# EAGLE design H3BR7 (EAGLE 9.6.1)

## Sheet 1 of 2
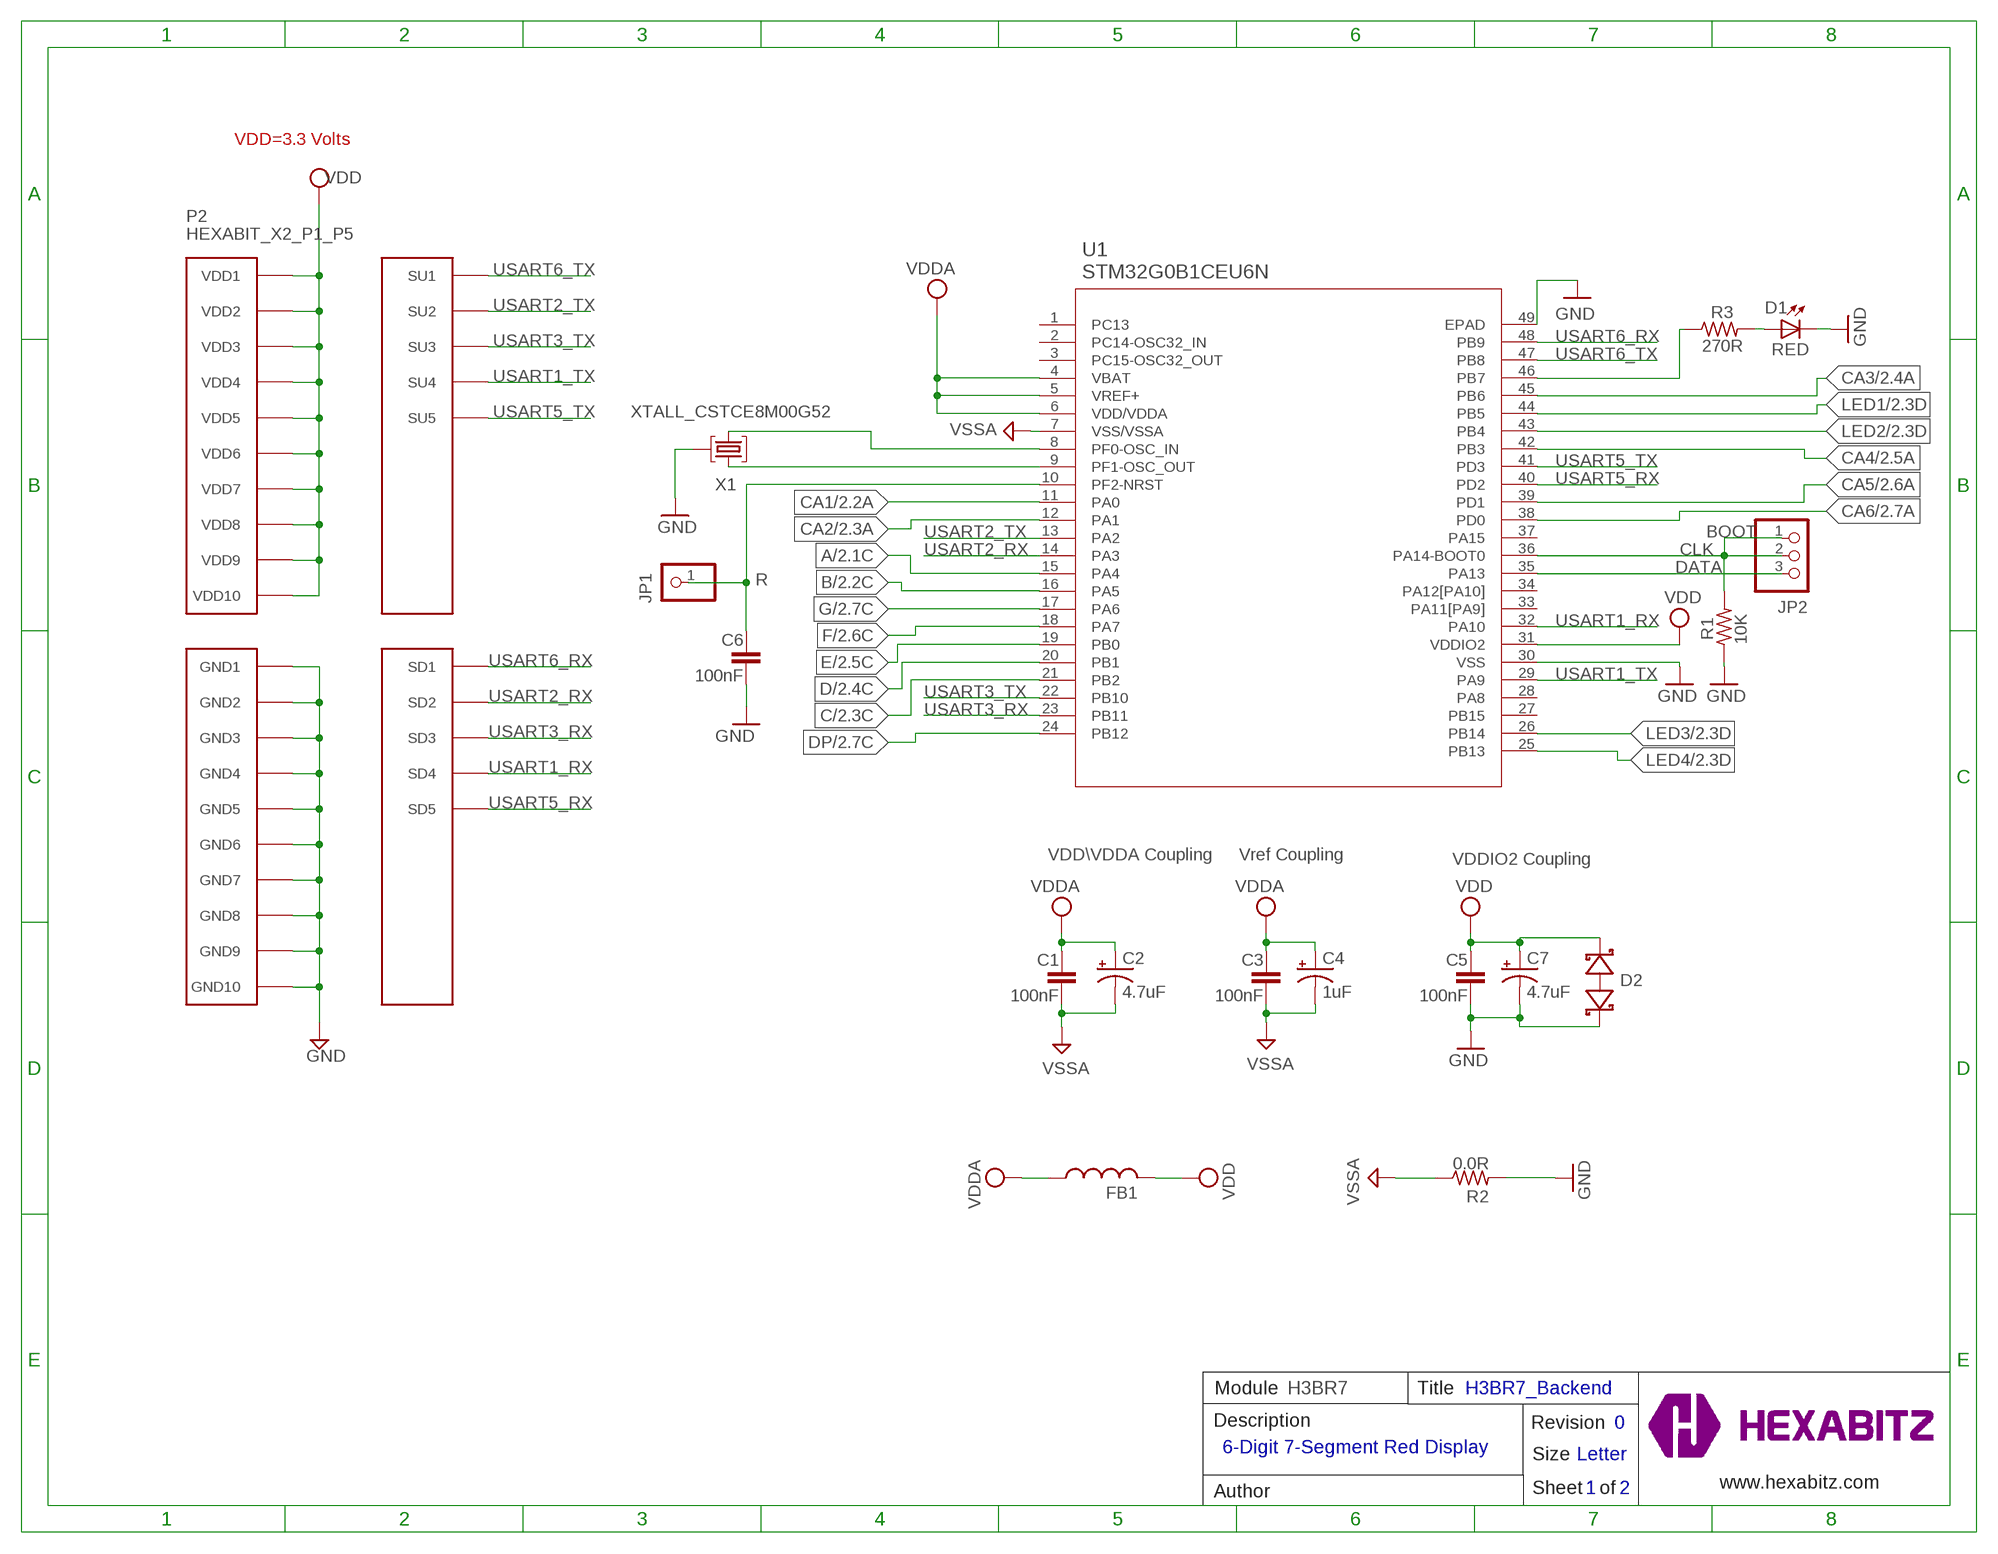
[diagram p0: schematic, sheet 1]

### Parts
C1  100nF  C-0603  [C-0603]
C2  4.7uF  C-0805-POL  [C-0805-POL]
C3  100nF  C-0603  [C-0603]
C4  1uF  C-0805-POL  [C-0805-POL]
C5  100nF  C-0603  [C-0603]
C6  100nF  C-0603  [C-0603]
C7  4.7uF  C-0805-POL  [C-0805-POL]
D1  RED  VLMS1300-GS08  [VLMS1300-GS08]
D2  BOURNS_CDSOD323-T03SCBOURNS_CDSOD323-T03SC_0_0  [BOURNS_CDSOD323-T03SC_0]
FB1  FB-0603  [FB-0603]
JP1  R  PINHD-1X1  [1X01]
JP2  PINHD-1X3  [1X03]
P2  HEXABIT_X2_P1_P5  [HEXABIT_17.32_X2_P1_P5]
R1  10K  R-0603  [R-0603]
R2  0.0R  R-0603  [R-0603]
R3  270R  R-0603  [R-0603]
U1  STM32G0B1CEU6N  [HEXABITZ_ICS_QFN_B1CEU6_STM-L]
X1  XTALL_CSTCE8M00G52  [XTALL_CSTCE8M00G52]

### Nets
A: U1.15(PA4) ; also sheet 2
B: U1.16(PA5) ; also sheet 2
C: U1.21(PB2) ; also sheet 2
CA1: U1.11(PA0) ; also sheet 2
CA2: U1.12(PA1) ; also sheet 2
CA3: U1.45(PB6) ; also sheet 2
CA4: U1.42(PB3) ; also sheet 2
CA5: U1.39(PD1) ; also sheet 2
CA6: U1.38(PD0) ; also sheet 2
CLK: JP2.1 JP2.2 R1.2 U1.36(PA14-BOOT0)
D: U1.20(PB1) ; also sheet 2
DATA: JP2.3 U1.35(PA13)
DP: U1.24(PB12) ; also sheet 2
E: U1.19(PB0) ; also sheet 2
F: U1.18(PA7) ; also sheet 2
G: U1.17(PA6) ; also sheet 2
GND: C5.2 C6.2 C7.2(-) D1.C D2.1(A) P2.PAD_PD11(GND1) P2.PAD_PD12(GND2) P2.PAD_PD13(GND3) P2.PAD_PD14(GND4) P2.PAD_PD15(GND5) P2.PAD_PD16(GND6) P2.PAD_PD17(GND7) P2.PAD_PD18(GND8) P2.PAD_PD19(GND9) P2.PAD_PD20(GND10) R1.1 R2.2 U1.30(VSS) U1.49(EPAD) X1.P$2 ; also sheet 2
LED1: U1.44(PB5) ; also sheet 2
LED2: U1.43(PB4) ; also sheet 2
LED3: U1.26(PB14) ; also sheet 2
LED4: U1.25(PB13) ; also sheet 2
N$1: D1.A R3.2
N$2: R3.1 U1.46(PB7)
N$5: U1.9(PF1-OSC_OUT) X1.P$1
N$6: U1.8(PF0-OSC_IN) X1.P$3
N$8: C6.1 JP1.1 U1.10(PF2-NRST)
USART1_RX: P2.PAD_PD4(SD4) U1.32(PA10)
USART1_TX: P2.PAD_PU4(SU4) U1.29(PA9)
USART2_RX: P2.PAD_PD2(SD2) U1.14(PA3)
USART2_TX: P2.PAD_PU2(SU2) U1.13(PA2)
USART3_RX: P2.PAD_PD3(SD3) U1.23(PB11)
USART3_TX: P2.PAD_PU3(SU3) U1.22(PB10)
USART5_RX: P2.PAD_PD5(SD5) U1.40(PD2)
USART5_TX: P2.PAD_PU5(SU5) U1.41(PD3)
USART6_RX: P2.PAD_PD1(SD1) U1.48(PB9)
USART6_TX: P2.PAD_PU1(SU1) U1.47(PB8)
VDD: C5.1 C7.1(+) D2.2(C) FB1.2 P2.PAD_PU11(VDD1) P2.PAD_PU12(VDD2) P2.PAD_PU13(VDD3) P2.PAD_PU14(VDD4) P2.PAD_PU15(VDD5) P2.PAD_PU16(VDD6) P2.PAD_PU17(VDD7) P2.PAD_PU18(VDD8) P2.PAD_PU19(VDD9) P2.PAD_PU20(VDD10) U1.31(VDDIO2) ; also sheet 2
VDDA: C1.1 C2.1(+) C3.1 C4.1(+) FB1.1 U1.4(VBAT) U1.5(VREF+) U1.6(VDD/VDDA)
VSSA: C1.2 C2.2(-) C3.2 C4.2(-) R2.1 U1.7(VSS/VSSA)
Unconnected: U1.1(PC13) U1.2(PC14-OSC32_IN) U1.3(PC15-OSC32_OUT) U1.27(PB15) U1.28(PA8) U1.33(PA11[PA9]) U1.34(PA12[PA10]) U1.37(PA15)

### Notes on the sheet
- VDD=3.3 Volts
- BOOT
- VDD\VDDA Coupling | Vref Coupling | VDDIO2 Coupling
- Module | H3BR7 | Title | H3BR7_Backend
- Description | Revision | 0
- 6-Digit 7-Segment Red Display
- Size | Letter
- www.hexabitz.com
- Author | Sheet   of | 1 | 2
- C:/Users/Admin/Desktop/logodraft.bmp

## Sheet 2 of 2
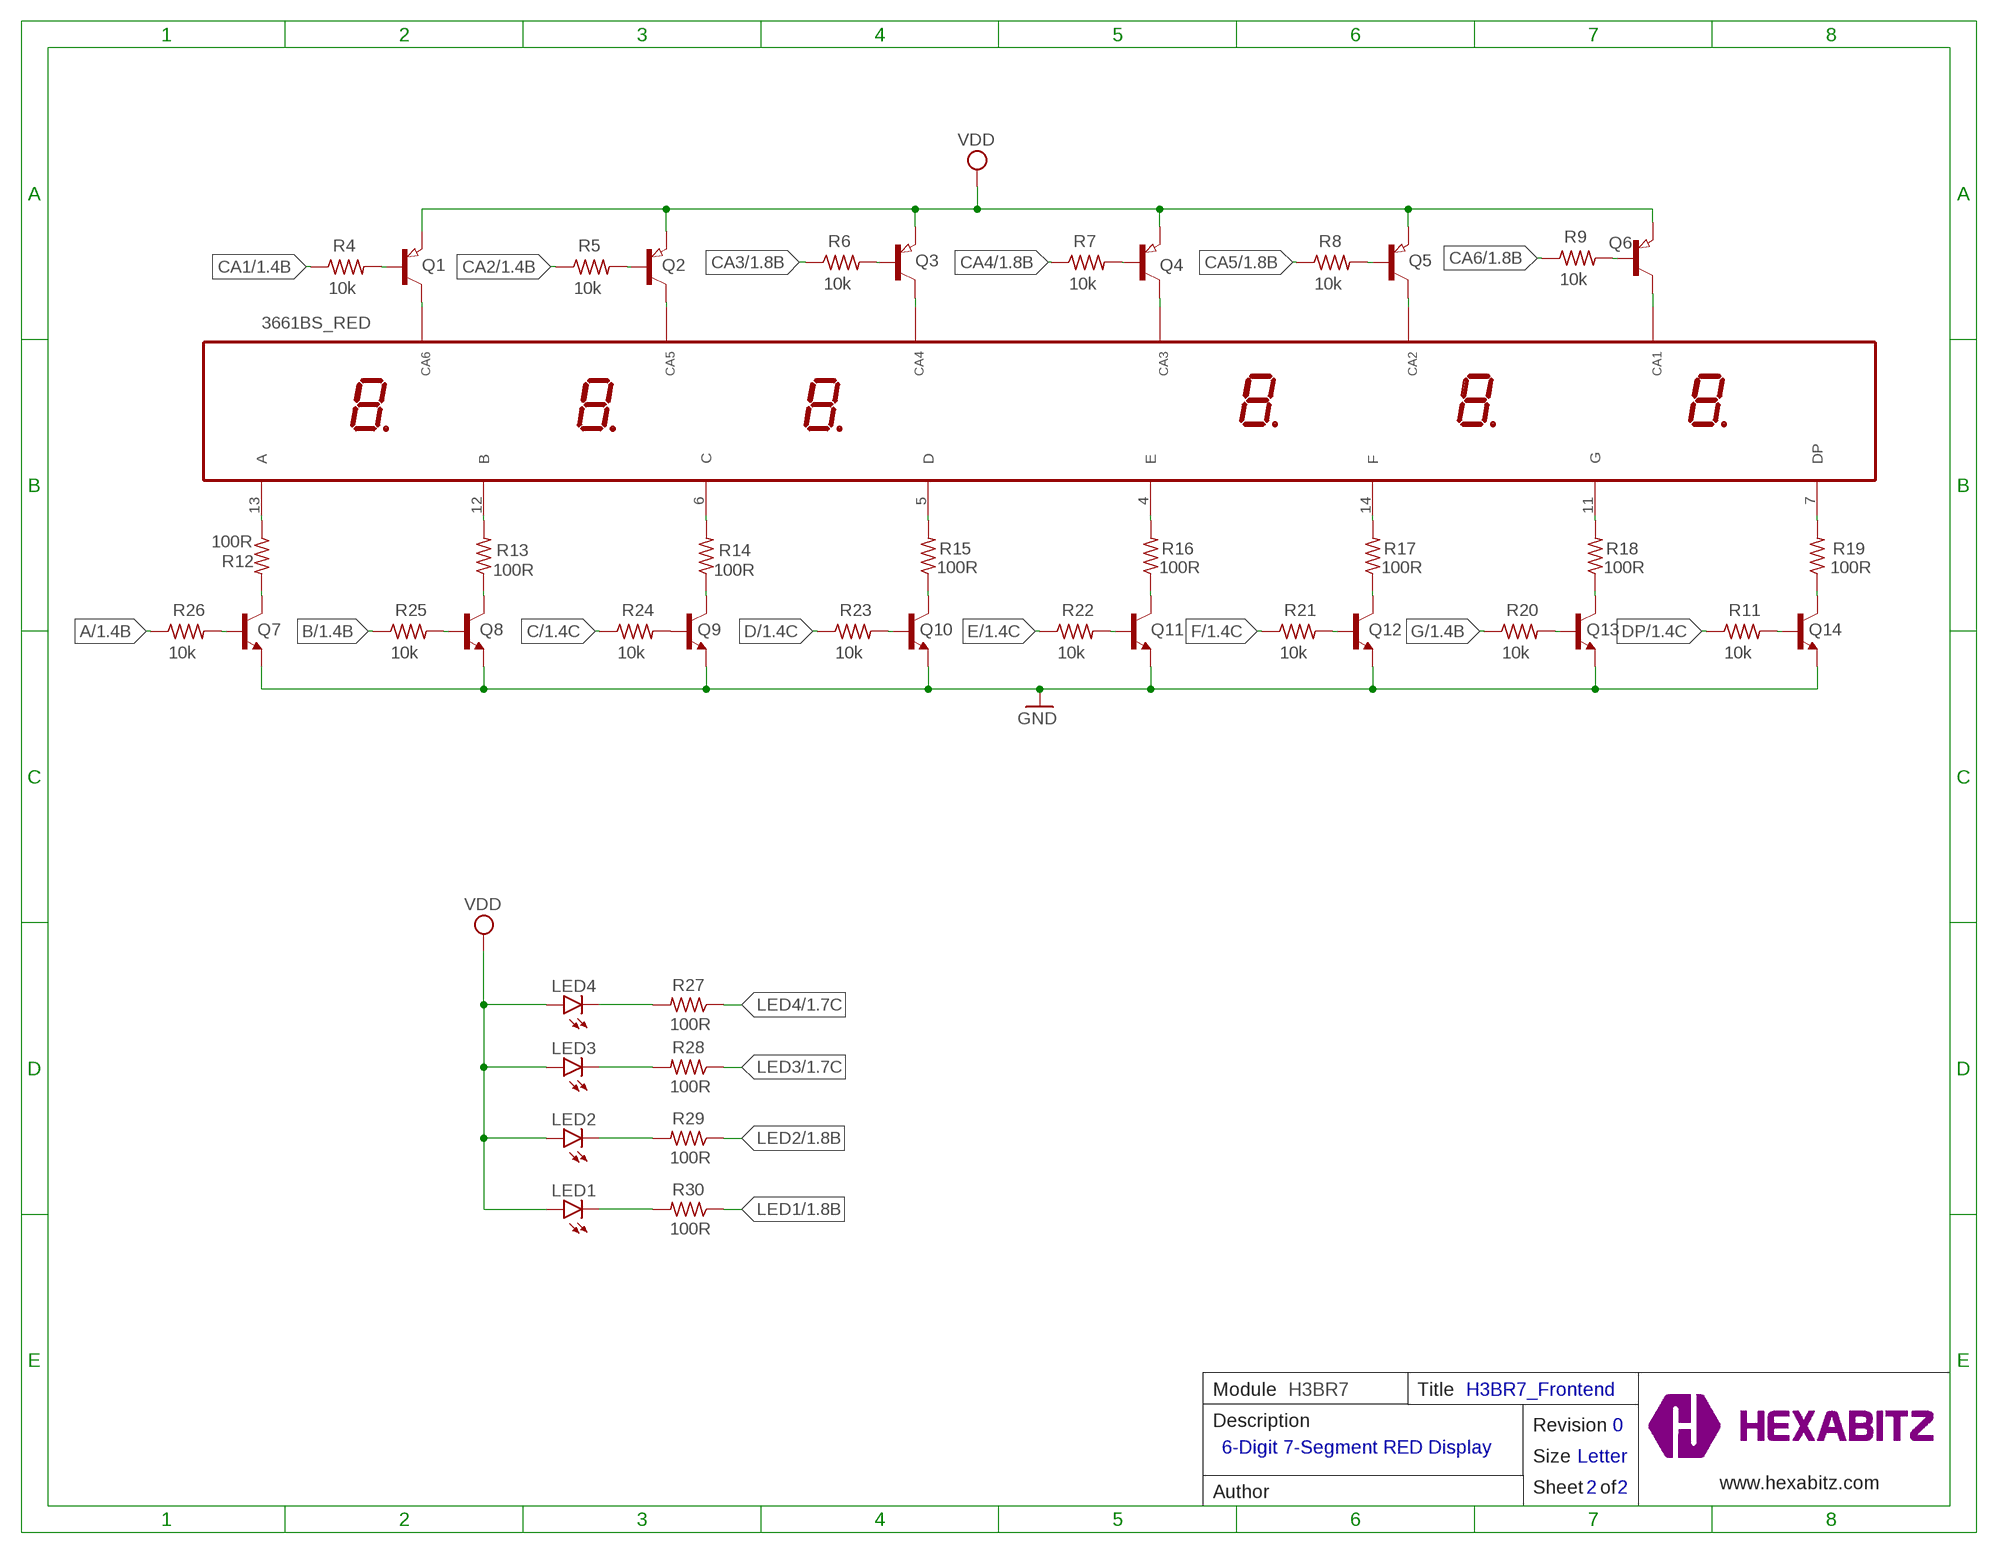
[diagram p1: schematic, sheet 2]

### Parts
3661BS  3661BS_RED  [3661BS]
LED1  LED-3MM3MM  [LED3MM]
LED2  LED-3MM3MM  [LED3MM]
LED3  LED-3MM3MM  [LED3MM]
LED4  LED-3MM3MM  [LED3MM]
Q1  SEMICON-SMD-IPC_PNP-TRANSISTOR_SOT23  [SEMICON-SMD-IPC_SOT23]
Q2  SEMICON-SMD-IPC_PNP-TRANSISTOR_SOT23  [SEMICON-SMD-IPC_SOT23]
Q3  SEMICON-SMD-IPC_PNP-TRANSISTOR_SOT23  [SEMICON-SMD-IPC_SOT23]
Q4  SEMICON-SMD-IPC_PNP-TRANSISTOR_SOT23  [SEMICON-SMD-IPC_SOT23]
Q5  SEMICON-SMD-IPC_PNP-TRANSISTOR_SOT23  [SEMICON-SMD-IPC_SOT23]
Q6  SEMICON-SMD-IPC_PNP-TRANSISTOR_SOT23  [SEMICON-SMD-IPC_SOT23]
Q7  MMBT3904LT1  [MMBT3904LT1]
Q8  MMBT3904LT1  [MMBT3904LT1]
Q9  MMBT3904LT1  [MMBT3904LT1]
Q10  MMBT3904LT1  [MMBT3904LT1]
Q11  MMBT3904LT1  [MMBT3904LT1]
Q12  MMBT3904LT1  [MMBT3904LT1]
Q13  MMBT3904LT1  [MMBT3904LT1]
Q14  MMBT3904LT1  [MMBT3904LT1]
R4  10k  R-0603  [R-0603]
R5  10k  R-0603  [R-0603]
R6  10k  R-0603  [R-0603]
R7  10k  R-0603  [R-0603]
R8  10k  R-0603  [R-0603]
R9  10k  R-0603  [R-0603]
R11  10k  R-0603  [R-0603]
R12  100R  R-0603  [R-0603]
R13  100R  R-0603  [R-0603]
R14  100R  R-0603  [R-0603]
R15  100R  R-0603  [R-0603]
R16  100R  R-0603  [R-0603]
R17  100R  R-0603  [R-0603]
R18  100R  R-0603  [R-0603]
R19  100R  R-0603  [R-0603]
R20  10k  R-0603  [R-0603]
R21  10k  R-0603  [R-0603]
R22  10k  R-0603  [R-0603]
R23  10k  R-0603  [R-0603]
R24  10k  R-0603  [R-0603]
R25  10k  R-0603  [R-0603]
R26  10k  R-0603  [R-0603]
R27  100R  R-0603  [R-0603]
R28  100R  R-0603  [R-0603]
R29  100R  R-0603  [R-0603]
R30  100R  R-0603  [R-0603]
TRIMBLE-LOGO1  HEXA-LOGO  [HEXA-LOGO]

### Nets
A: R26.1 ; also sheet 1
B: R25.1 ; also sheet 1
C: R24.1 ; also sheet 1
CA1: R4.1 ; also sheet 1
CA2: R5.1 ; also sheet 1
CA3: R6.1 ; also sheet 1
CA4: R7.1 ; also sheet 1
CA5: R8.1 ; also sheet 1
CA6: R9.1 ; also sheet 1
D: R23.1 ; also sheet 1
DP: R11.1 ; also sheet 1
E: R22.1 ; also sheet 1
F: R21.1 ; also sheet 1
G: R20.1 ; also sheet 1
GND: Q7.2(E) Q8.2(E) Q9.2(E) Q10.2(E) Q11.2(E) Q12.2(E) Q13.2(E) Q14.2(E) ; also sheet 1
LED1: R30.1 ; also sheet 1
LED2: R29.1 ; also sheet 1
LED3: R28.1 ; also sheet 1
LED4: R27.1 ; also sheet 1
N$3: 3661BS.13(A) R12.1
N$4: Q7.1(B) R26.2
N$7: Q8.3(C) R13.1
N$9: 3661BS.6(C) R14.2
N$10: Q8.1(B) R25.2
N$11: Q9.1(B) R24.2
N$12: Q10.1(B) R23.2
N$13: Q11.1(B) R22.2
N$14: Q12.1(B) R21.2
N$15: Q13.1(B) R20.2
N$16: Q14.1(B) R11.2
N$17: Q10.3(C) R15.1
N$18: 3661BS.5(D) R15.2
N$19: Q11.3(C) R16.1
N$20: Q13.3(C) R18.1
N$21: 3661BS.11(G) R18.2
N$22: Q7.3(C) R12.2
N$23: LED4.K(C) R27.2
N$24: LED3.K(C) R28.2
N$25: Q1.1(B) R4.2
N$26: Q2.1(B) R5.2
N$27: Q3.1(B) R6.2
N$28: Q4.1(B) R7.2
N$29: Q5.1(B) R8.2
N$30: Q6.1(B) R9.2
N$31: 3661BS.1(CA) Q6.3(C)
N$32: LED2.K(C) R29.2
N$33: LED1.K(C) R30.2
N$34: 3661BS.8(CA) Q1.3(C)
N$35: 3661BS.9(CA) Q2.3(C)
N$36: 3661BS.10(CA) Q3.3(C)
N$37: 3661BS.3(CA) Q4.3(C)
N$38: 3661BS.2(CA) Q5.3(C)
N$39: 3661BS.7(DP) R19.2
N$40: Q14.3(C) R19.1
N$41: 3661BS.4(E) R16.2
N$42: 3661BS.14(F) R17.2
N$43: 3661BS.12(B) R13.2
N$44: Q12.3(C) R17.1
N$45: Q9.3(C) R14.1
VDD: LED1.A LED2.A LED3.A LED4.A Q1.2(E) Q2.2(E) Q3.2(E) Q4.2(E) Q5.2(E) Q6.2(E) ; also sheet 1

### Notes on the sheet
- Module | H3BR7 | Title | H3BR7_Frontend
- Description | Revision | 0
- 6-Digit 7-Segment RED Display
- Size | Letter
- Sheet   of | 2 | 2 | www.hexabitz.com
- Author
- C:/Users/Admin/Desktop/logodraft.bmp

## Library data of the parts
3661BS = HEXABITZ_ICs:3661BS_RED: 0.36inch 6digits RED 8 segment led display 3661BS
C1 C3 C5 C6 = HEXABITZ_RCLS:C-0603: CAP CER 10% X7R 0603
C2 C4 C7 = HEXABITZ_RCLS:C-0805-POL: Cap Tant Solid SMD 2012
D1 = Hexabitz:VLMS1300-GS08: Red 0603 130° Clear 54 mcd 2 V Surface Mount ChipLED ; Octopart Url : http://octopart.com/vlms1300-gs08-vishay-21709201; MFN: Vishay; MPN: VLMS1300-GS08; OCTOPART_URL: https://octopart.com/vlms1300-gs08-vishay-21709201?r=sp&s=_gcP4_q8T1SC6PJQPTQ9yA
D2 = HEXABITZ_RCLS:BOURNS_CDSOD323-T03SC: CDSOD323-TxxSC - TVS Diode Series; DESCRIPTION: Dio Tvs Vwm 03V 500W Bidir Sod323 / Tape & Reel - 7" Reel; MFN: Bourns; MPN: CDSOD323-T03SC; OCTOPART_URL: https://octopart.com/cdsod323-t03sc-bourns-10487153?r=sp
FB1 = HEXABITZ_RCLS:FB-0603: Ferrite Beads Multi-Layer 0603
JP1 = HEXABITZ_USER_INTERFACE_PARTS:PINHD-1X1: PIN HEADER; MFN: TE Connectivity; MPN: 87227-1; OCTOPART_URL: https://octopart.com/87227-1-te+connectivity-39512052?r=sp
JP2 = pinhead:PINHD-1X3: PIN HEADER
LED1-LED4 = HEXABITZ_USER_INTERFACE_PARTS:LED-3MM: LED OSRAM: - CHIPLED LG R971, LG N971, LY N971, LG Q971, LY Q971, LO R971, LY R971 LH N974, LH R974 LS Q976, LO Q976, LY Q976 LO Q996 - Hyper CHIPLED LW Q18S LB Q993, LB Q99A, LB R99A - SideLED LS A670, LO A670, LY A670, LG A670, LP A670 LB A673, LV A673, LT A673, LW A673 LH A674 LY A675 LS A676, LA A676, LO A676, LY A676, LW A676 LS A679, LY A679, LG A679 - Hyper Micro SIDELED® LS Y876, LA Y876, LO Y876, LY Y876 LT Y87S - SmartLED LW L88C, LW L88S LB L89C, LB L89S, LG L890 LS L89K, LO L89K, LY L89K LS L896, LA L896, LO L896, LY L896 - TOPLED LS T670, LO T670, LY T670, LG T670, LP T670 LSG T670, LSP T670, LSY T670, LOP T670, LYG T670 LG T671, LOG T671, LSG T671 LB T673, LV T673, LT T673, LW T673 LH T674 LS T676, LA T676, LO T676, LY T676, LB T676, LH T676, LSB T676, LW T676 LB T67C, LV T67C, LT T67C, LS T67K, LO T67K, LY T67K, LW E67C LS E67B, LA E67B, LO E67B, LY E67B, LB E67C, LV E67C, LT E67C LW T67C LS T679, LY T679, LG T679 LS T770, LO T770, LY T770, LG T770, LP T770 LB T773, LV T773, LT T773, LW T773 LH T774 LS E675, LA E675, LY E675, LS T675 LS T776, LA T776, LO T776, LY T776, LB T776 LHGB T686 LT T68C, LB T68C - Hyper Mini TOPLED® LB M676 - Mini TOPLED Santana® LG M470 LS M47K, LO M47K, LY M47K Source: http://www.osram.convergy.de LUXEON: - LUMILED® LXK2-PW12-R00, LXK2-PW12-S00, LXK2-PW14-U00, LXK2-PW14-V00 LXK2-PM12-R00, LXK2-PM12-S00, LXK2-PM14-U00 LXK2-PE12-Q00, LXK2-PE12-R00, LXK2-PE12-S00, LXK2-PE14-T00, LXK2-PE14-U00 LXK2-PB12-K00, LXK2-PB12-L00, LXK2-PB12-M00, LXK2-PB14-N00, LXK2-PB14-P00, LXK2-PB14-Q00 LXK2-PR12-L00, LXK2-PR12-M00, LXK2-PR14-Q00, LXK2-PR14-R00 LXK2-PD12-Q00, LXK2-PD12-R00, LXK2-PD12-S00 LXK2-PH12-R00, LXK2-PH12-S00 LXK2-PL12-P00, LXK2-PL12-Q00, LXK2-PL12-R00 Source: www.luxeon.com KINGBRIGHT: KA-3528ASYC Source: www.kingbright.com
P2 = hexabitz_connectors:HEXABIT_X2_P1_P5
Q1-Q6 = HEXABITZ_RCLS:SEMICON-SMD-IPC_PNP-TRANSISTOR_: PNP TRANSISTOR
Q7-Q14 = HEXABITZ_RCLS:MMBT3904LT1: TRANS NPN 40V 0.2A SOT23; MOUNTING_STYLE: Surface Mount; NUM_OF_PINS: 3; PACKAGE: SOT-23-3; PACKAGING: Reel; PRODUCT_CATEGORY: Transistors Bipolar-BJT; SERIES: MMBT3904L
R1-R9 R11-R30 = HEXABITZ_RCLS:R-0603: Thick Film Resistors - SMD 0603
TRIMBLE-LOGO1 = HEXABITZ_USER_INTERFACE_PARTS:HEXA-LOGO: Trimble-Logo
U1 = HEXABITZ_ICs:STM32G0B1CEU6N
X1 = Hexabitz:XTALL_CSTCE8M00G52: MURATA CSTCE8M00G52-R0 RESONATOR, SMD, 8MHZ ; Octopart Url : https://octopart.com/cstce8m00g52-r0-murata-7145559; MFN: Murata; MPN: CSTCE8M00G52Z-R0; OCTOPART_URL: https://octopart.com/cstce8m00g52z-r0-murata-17755941?r=sp&s=JDnNJnrHQhyS8Zk4ofFWXw

## Board
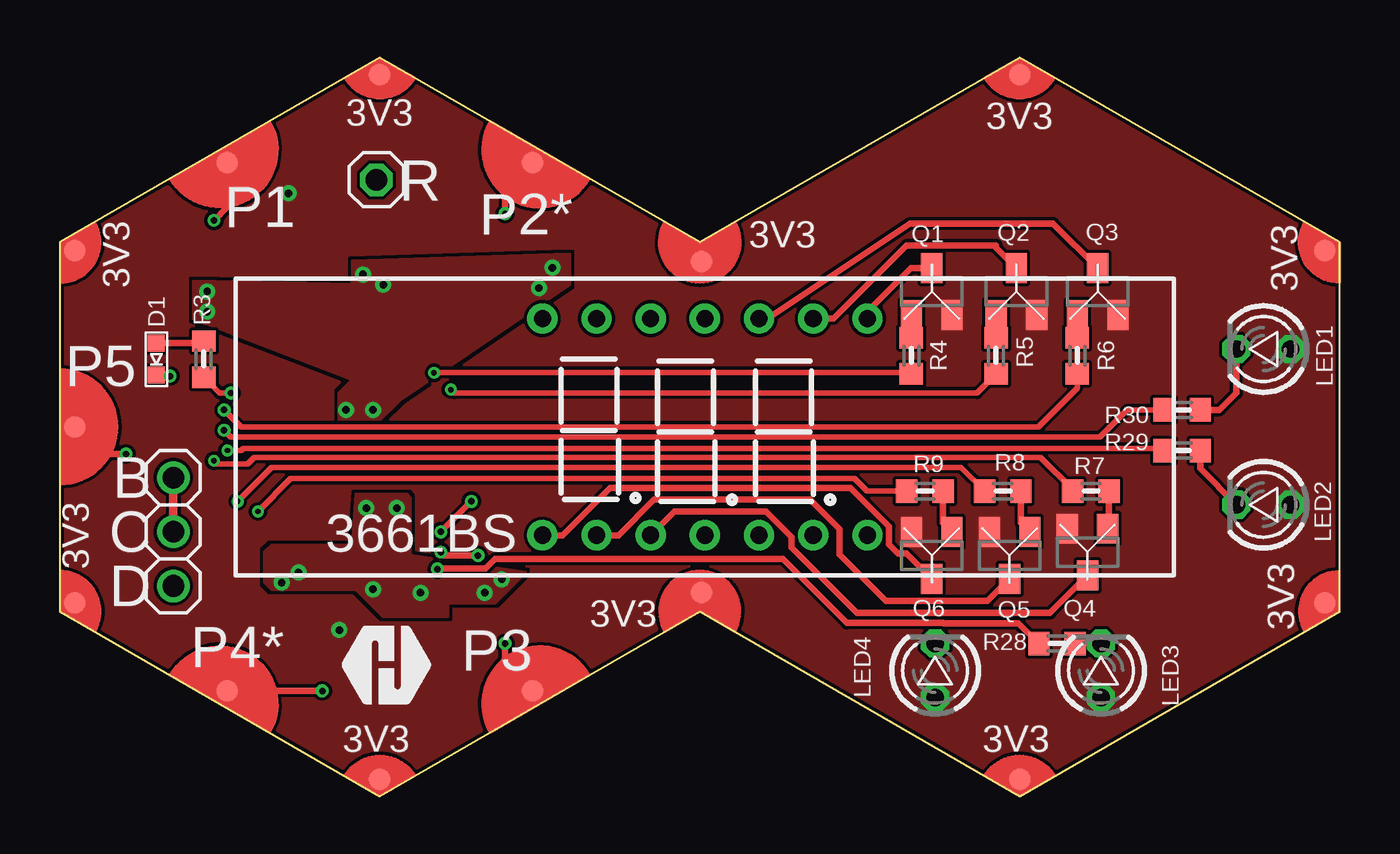
[diagram p2: board, top side]
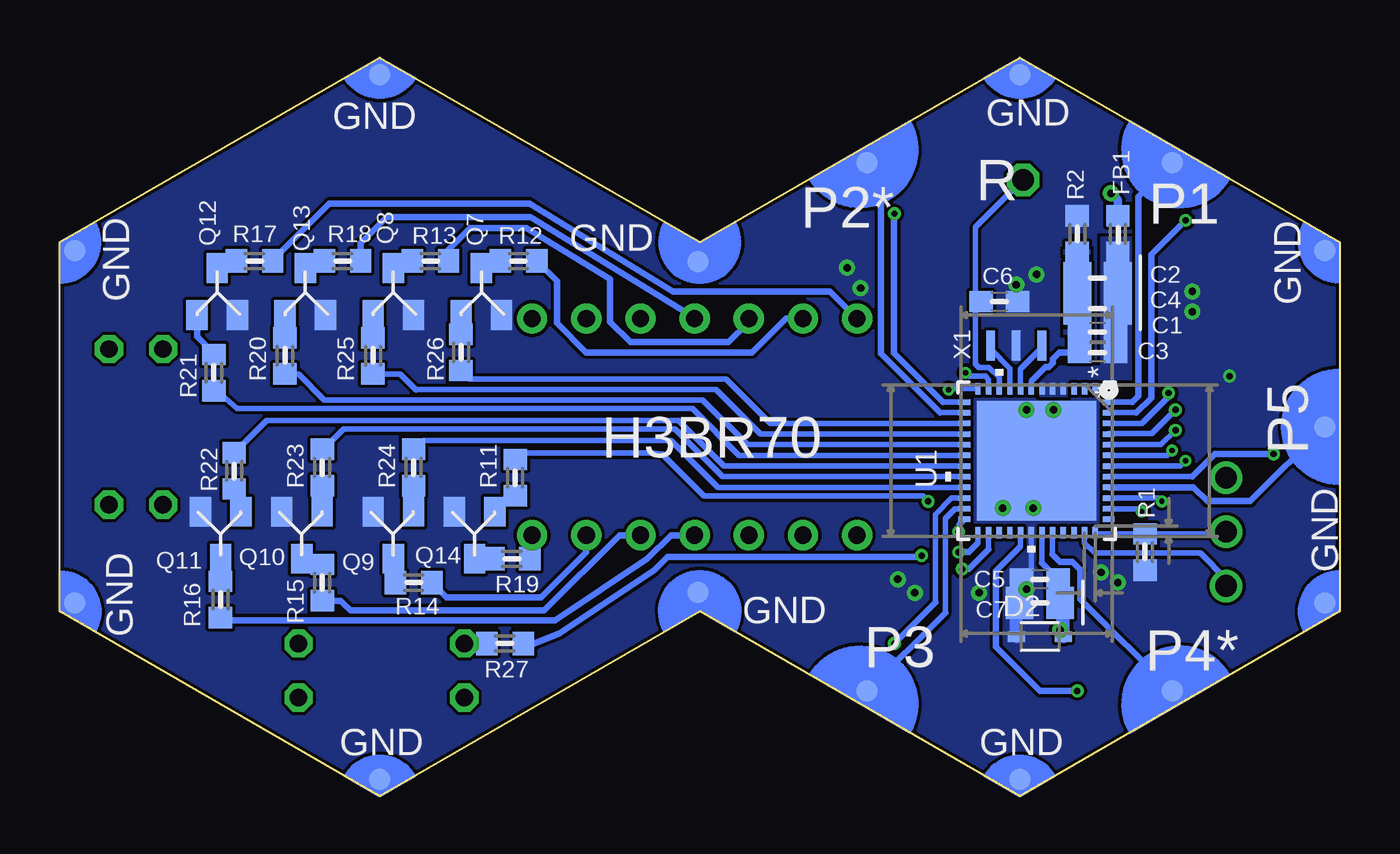
[diagram p3: board, bottom side, seen from below]

Size 60 x 34.64 mm. Coordinates in mm from the lower left corner, seen from the top.
Copper layers (1*16): Top 0.035mm / dielectric 1.5mm / Bottom 0.035mm
Design rules "default *": minimum track width 6mil, minimum drill 0.2mm, track to track 6mil, track to pad 6mil, pad to pad 6mil, via to via 6mil, smd to smd 0mil, copper to edge 0.15mm, drill to drill 6mil, minimum pad ring 10mil, minimum via ring 4mil, stop-mask expansion 4mil, vias tented up to drill 24mil, thermal gap 10mil

### Footprints (pad centres in the part's own frame; a part is rotated, then mirrored left to right if it is on the bottom)
3661BS = drill 0.8 pad 1.422: 1 -7.62,-5.08; 2 -5.08,-5.08; 3 -2.54,-5.08; 4 0,-5.08; 5 2.54,-5.08; 6 5.08,-5.08; 7 7.62,-5.08; 8 7.62,5.08; 9 5.08,5.08; 10 2.54,5.08; 11 0,5.08; 12 -2.54,5.08; 13 -5.08,5.08; 14 -7.62,5.08
C-0603 = smd 1.1 x 1: 1 -0.85,0; 2 0.85,0
C-0805-POL = smd 1.3 x 1.5: 1 -0.95,0; 2 0.95,0
VLMS1300-GS08 = smd 0.8 x 0.8: A 0,0.75; C 0,-0.75
BOURNS_CDSOD323-T03SC_0 = smd 0.8 x 0.5: 1 -1.1,0; 2 1.1,0
FB-0603 = smd 1 x 1.1: 1 -0.85,0; 2 0.85,0
1X01 = drill 1.016 octagon: 1 0,0
1X03 = drill 1.016: 1 -2.54,0; 2 0,0; 3 2.54,0
LED3MM = drill 0.813 octagon: A -1.27,0; K 1.27,0
HEXABIT_17.32_X2_P1_P5 = smd 1 x 1 bottom: PAD_PD1 12.39,22.39; PAD_PD2 12.39,8.09; PAD_PD3 -12.39,8.09; PAD_PD4 -12.39,22.39; PAD_PD5 0,29.55; PAD_PD12 16.52,15.24; PAD_PD13 7.752,0.168; PAD_PD14 16.52,-14.76; PAD_PD15 8.26,-29.07; PAD_PD16 -8.26,-29.07; PAD_PD17 -16.52,-14.76; PAD_PD18 -7.752,0.168; PAD_PD19 -16.52,15.24 | smd 1 x 1 rotated 60 bottom: PAD_PD11 8.26,29.547 | smd 1 x 1 rotated 120 bottom: PAD_PD20 -8.26,29.547 | smd 1 x 1: PAD_PU1 12.39,22.39; PAD_PU2 12.39,8.09; PAD_PU3 -12.39,8.09; PAD_PU4 -12.39,22.39; PAD_PU5 0,29.55; PAD_PU12 16.52,15.24; PAD_PU13 7.752,0.168; PAD_PU14 16.52,-14.76; PAD_PU15 8.26,-29.07; PAD_PU16 -8.26,-29.07; PAD_PU17 -16.52,-14.76; PAD_PU18 -7.752,0.168; PAD_PU19 -16.52,15.24 | smd 1 x 1 rotated 60: PAD_PU11 8.26,29.547 | smd 1 x 1 rotated 120: PAD_PU20 -8.26,29.547
SEMICON-SMD-IPC_SOT23 = smd 1 x 1.4: 1 -0.95,-1.1; 2 0.95,-1.1; 3 0,1.1
MMBT3904LT1 = smd 1 x 1.4: 1 -0.95,-1.1; 2 0.95,-1.1; 3 0,1.1
R-0603 = smd 1 x 1.1: 1 -0.85,0; 2 0.85,0
HEXABITZ_ICS_QFN_B1CEU6_STM-L = smd 0.55 x 0.254: 1 -3.38,2.751; 2 -3.38,2.251; 3 -3.38,1.75; 4 -3.38,1.25; 5 -3.38,0.75; 6 -3.38,0.25; 7 -3.38,-0.25; 8 -3.38,-0.75; 9 -3.38,-1.25; 10 -3.38,-1.75; 11 -3.38,-2.251; 12 -3.38,-2.751; 25 3.38,-2.751; 26 3.38,-2.251; 27 3.38,-1.75; 28 3.38,-1.25; 29 3.38,-0.75; 30 3.38,-0.25; 31 3.38,0.25; 32 3.38,0.75; 33 3.38,1.25; 34 3.38,1.75; 35 3.38,2.251; 36 3.38,2.751 | smd 0.254 x 0.55: 13 -2.751,-3.38; 14 -2.251,-3.38; 15 -1.75,-3.38; 16 -1.25,-3.38; 17 -0.75,-3.38; 18 -0.25,-3.38; 19 0.25,-3.38; 20 0.75,-3.38; 21 1.25,-3.38; 22 1.75,-3.38; 23 2.251,-3.38; 24 2.751,-3.38; 37 2.751,3.38; 38 2.251,3.38; 39 1.75,3.38; 40 1.25,3.38; 41 0.75,3.38; 42 0.25,3.38; 43 -0.25,3.38; 44 -0.75,3.38; 45 -1.25,3.38; 46 -1.75,3.38; 47 -2.251,3.38; 48 -2.751,3.38 | smd 5.6 x 5.6: 49 0,0
XTALL_CSTCE8M00G52 = smd 1.4 x 0.4: P$1 0,1.2; P$2 0,0; P$3 0,-1.2

### Placement (x,y rotation side)
3661BS  30.24,17.32 0 top
C1  11.35,21.77 180 bottom
C2  11.35,24.3 180 bottom
C3  11.35,20.81 180 bottom
C4  11.35,22.88 180 bottom
C5  14.05,10.18 180 bottom
C6  15.95,23.19 0 bottom
C7  14.05,9.07 180 bottom
D1  4.52,20.5 0 top
D2  14.05,7.48 0 bottom
FB1  10.4,26.37 90 bottom
JP1  14.84,28.91 0 top
JP2  5.32,12.4 270 top
LED1  56.43,20.97 180 top
LED2  56.43,13.67 180 top
LED3  48.81,5.89 90 top
LED4  41.03,5.89 90 top
P2  30.24,17.32 90 top
Q1  40.88,23.67 0 top
Q2  44.84,23.67 0 top
Q3  48.66,23.67 0 top
Q4  48.18,11.45 180 top
Q5  44.53,11.29 180 top
Q6  40.88,11.29 180 top
Q7  40.24,23.67 0 bottom
Q8  44.37,23.67 0 bottom
Q9  44.37,12.24 180 bottom
Q10  48.66,12.24 180 bottom
Q11  52.47,12.24 180 bottom
Q12  52.62,23.67 0 bottom
Q13  48.5,23.67 0 bottom
Q14  40.56,12.24 180 bottom
R1  9.13,11.45 90 bottom
R2  12.3,26.37 90 bottom
R3  6.75,20.5 90 top
R4  39.92,20.65 90 top
R5  43.89,20.65 90 top
R6  47.7,20.65 90 top
R7  48.34,14.3 0 top
R8  44.21,14.3 0 top
R9  40.56,14.3 0 top
R11  38.65,14.94 270 bottom
R12  38.49,25.1 180 bottom
R13  42.62,25.1 0 bottom
R14  43.42,10.02 0 bottom
R15  47.7,10.02 270 bottom
R16  52.47,9.22 270 bottom
R17  50.88,25.1 0 bottom
R18  46.75,25.1 0 bottom
R19  38.81,11.13 0 bottom
R20  49.45,20.65 90 bottom
R21  52.78,19.86 90 bottom
R22  51.83,15.26 270 bottom
R23  47.7,15.42 270 bottom
R24  43.42,15.42 270 bottom
R25  45.32,20.65 90 bottom
R26  41.19,20.81 90 bottom
R27  39.13,7.16 180 bottom
R28  46.75,7.16 0 top
R29  52.62,16.21 0 top
R30  52.62,18.11 0 top
TRIMBLE-LOGO1  15.32,4.3 0 top
U1  14.21,15.73 270 bottom
X1  15.16,21.13 90 bottom

### Tracks (layer width: path | path; a pad name or v marks a point on that pad's centre or on a via)
A
  Bottom 0.254: R26.1 40.79,19.56 28.78,19.56 26.69,17.48 U1.15
B
  Bottom 0.254: R25.1 44.05,19.8 43.31,19.06 43.29,19.07 29.23,19.07 27.15,16.98 U1.16
C
  Bottom 0.254: R24.1 43.36,16.26 42.94,16.68 31.35,16.68 29.15,14.48 U1.21
CA1  (via drill 0.25 pad 0.55)
  Top 0.254: R4.1 39.87,19.86 v17.54,19.86
  Bottom 0.254: U1.11 16.46,19.55 16.61,19.7 17.38,19.7 v17.54,19.86
CA2  (via drill 0.25 pad 0.55)
  Top 0.254: R5.1 43,18.91 18.49,18.91 v18.33,19.07
  Bottom 0.254: U1.12 18.29,19.11 v18.33,19.07
CA3  (via drill 0.3 pad 0.6)
  Top 0.254: R6.1 47.7,19.15 45.87,17.32 8.49,17.32 v7.7,18.11
  Bottom 0.254: v7.7,18.11 8.81,17 10.81,17 U1.45
CA4  (via drill 0.25 pad 0.55)
  Top 0.254: R7.1 47.49,14.38 45.98,15.89 9.12,15.89 8.81,15.58 7.37,15.58 v7.22,15.73
  Bottom 0.254: U1.42 7.47,15.48 v7.22,15.73
CA5  (via drill 0.25 pad 0.55)
  Top 0.254: R8.1 42.25,15.41 9.92,15.41 v8.33,13.83
  Bottom 0.254: v8.33,13.83 8.49,13.98 U1.39
CA6  (via drill 0.25 pad 0.55)
  Top 0.254: R9.1 37.84,14.3 37.25,14.89 10.83,14.89 v9.29,13.35
  Bottom 0.254: U1.38 9.42,13.48 v9.29,13.35
CLK
  Top 0.406: JP2.1 JP2.2
  Bottom 0.254: JP2.2 5.42,12.3 R1.2 11.4,12.3 U1.36
D
  Bottom 0.254: R23.1 47.7,16.21 46.7,17.21 31.17,17.21 28.94,14.98 U1.20
DATA
  Bottom 0.254: U1.35 11.96,11.88 11.48,11.4 6.54,11.4 5.32,10.18 JP2.3
DP  (via drill 0.3 pad 0.6)
  Top 0.254: v19.29,13.83 v17.86,12.4
  Bottom 0.254: R11.1 38.34,16.11 32.17,16.11 31.77,16.05 29.79,14.08 19.53,14.08 v19.29,13.83 | U1.24 17.86,12.71 v17.86,12.4
E
  Bottom 0.254: R22.1 50.32,17.62 31,17.62 28.86,15.48 18.07,15.48 18.06,15.48 U1.19
F
  Bottom 0.254: R21.1 52.62,19.01 51.68,18.18 30.35,18.18 28.15,15.98 U1.18
G
  Bottom 0.254: R20.1 48.81,19.8 47.6,18.59 29.87,18.59 27.76,16.48 U1.17
GND  (via drill 0.3 pad 0.6, 0.35 pad 0.75)
  Top 0.254: D1.C 5.11,19.74 v5.16,19.7
  Bottom 0.254: U1.30 14.46,10.62
  Bottom 0.305: 14.46,10.62 C5.2
  Bottom 0.61: D2.1 15.15,8.91 C7.2
  other vias: 14.68,9.7 16.91,9.54 14.37,13.51 15.79,13.51 10.4,10.02 11.19,10.49 13.41,18.11 14.68,18.11 14.21,24.46 15.16,23.99 6.9,23.67 6.9,22.72 23.1,24.78 22.46,23.83 20.71,10.18 19.92,9.54
  pour Bottom (rank 2, no thermals): 29.65,26.02 14.85,34.49 0.16,26.05 0.08,8.81 14.98,0.09 29.98,8.67 44.98,0.1 59.93,8.59 59.93,25.89 45.14,34.54 29.94,25.87
  pour Top: 18.17,8.43 18.17,9.07 20.4,9.07 21.83,10.49 16.43,11.29 16.43,13.99 16.27,14.15 13.89,14.15 13.73,11.76 9.92,11.76 9.6,11.45 9.6,10.02 9.92,9.7 13.89,9.7 15.16,8.43
  pour Top: 15,17.64 13.09,17.64 13.09,18.91 13.73,19.54 6.27,22.4 6.27,24.15 13.73,23.99 13.73,25.1 23.89,25.42 23.89,23.99 15.95,18.59
LED1  (via drill 0.3 pad 0.6)
  Top 0.254: R30.1 50.03,18.11 48.76,16.84 8.02,16.84 v7.7,17.16
  Bottom 0.254: U1.44 8.38,16.48 v7.7,17.16
LED2  (via drill 0.25 pad 0.55)
  Top 0.254: R29.1 51.68,16.3 8.58,16.3 8.49,16.21 v7.86,16.21
  Bottom 0.254: v7.86,16.21 8.08,15.98 U1.43
LED3  (via drill 0.3 pad 0.6)
  Top 0.305: R28.1 44.95,8.11 41.45,8.11 41.43,8.12 36.89,8.12 33.89,11.13 20.41,11.13 19.96,10.68 17.73,10.68 v17.7,10.65
  Bottom 0.254: U1.26 16.46,11.58
  Bottom 0.305: v17.7,10.65 17.38,10.65 16.46,11.58
LED4  (via drill 0.3 pad 0.6)
  Top 0.305: v19.6,11.29 18.02,11.29 v17.86,11.45
  Bottom 0.254: 17.39,11.45 16.96,11.88 U1.25
  Bottom 0.305: R27.1 37.74,7.16 36.58,7.64 32.13,10.62 31.52,11.22 19.67,11.22 v19.6,11.29 | v17.86,11.45 17.39,11.45
N$1
  Top 0.305: D1.A 6.65,21.24 R3.2
N$2  (via drill 0.3 pad 0.6)
  Top 0.254: v8.02,18.91 7.48,18.91 R3.1
  Bottom 0.254: v8.02,18.91 8.02,18.75 9.28,17.48 U1.46
N$3
  Bottom 0.305: 3661BS.13 25.95,22.4 27.54,20.81 35.33,20.81 36.69,22.18 36.69,24.15 R12.1
N$4
  Bottom 0.305: Q7.1 41.19,21.86 R26.2
N$5
  Bottom 0.254: U1.9 15.46,20.06 16.36,20.97 X1.P$1
N$6
  Bottom 0.254: U1.8 14.96,20.04 13.96,21.03 X1.P$3
N$7
  Bottom 0.305: Q8.3 44.04,25.1 R13.1
N$8
  Bottom 0.152: C6.1 16.9,23.19 17.06,23.03
  Bottom 0.254: JP1.1 17.06,26.69 17.06,23.03 17.06,20.27 16.9,20.11 16.44,20.11 15.96,19.62 U1.10
N$9
  Bottom 0.305: 3661BS.6 35.32,11.44 37.44,9.32 41.87,9.32 R14.2
N$10
  Bottom 0.305: Q8.1 45.16,22.41 45.16,21.39 45.21,21.39 R25.2
N$11
  Bottom 0.305: R24.2 43.47,13.39 Q9.1
N$12
  Bottom 0.305: R23.2 47.6,13.44 Q10.1
N$13
  Bottom 0.305: R22.2 51.52,14.09 Q11.1
N$14
  Bottom 0.305: Q12.1 53.57,21.55 52.78,20.76 R21.2
N$15
  Bottom 0.305: Q13.1 49.45,22.34 R20.2
N$16
  Bottom 0.305: Q14.1 39.22,13.72 R11.2
N$17
  Bottom 0.305: R15.1 48.55,11.04 Q10.3
N$18
  Bottom 0.305: 3661BS.5 33.77,12.24 37.31,8.71 46.37,8.71 46.69,9.02 46.83,9.17 R15.2
N$19
  Bottom 0.305: Q11.3 52.52,11.14 R16.1
N$20
  Bottom 0.305: Q13.3 48.17,25.1 R18.1
N$21
  Bottom 0.305: 3661BS.11 30.3,22.46 37.92,27.16 44.69,27.16 45.9,25.95 R18.2
N$22
  Bottom 0.305: R12.2 39.91,25.1 Q7.3
N$23
  Bottom 0.305: LED4.K R27.2
N$24
  Top 0.305: LED3.K R28.2
N$25
  Top 0.305: R4.2 Q1.1
N$26
  Top 0.305: Q2.1 43.9,21.98 43.89,21.98 R5.2
N$27
  Top 0.305: Q3.1 R6.2
N$28
  Top 0.305: R7.2 49.19,12.6 Q4.1
N$29
  Top 0.305: R8.2 45.06,12.8 Q5.1
N$30
  Top 0.305: R9.2 41.41,12.8 Q6.1
N$31
  Top 0.305: 3661BS.1 23.57,12.24 25.79,14.46 37.07,14.46 38.88,12.66 38.88,11.81 39.3,11.38 39.68,11.38 Q6.3
N$32
  Top 0.305: R29.2 53.47,15.36 LED2.K
N$33
  Top 0.305: R30.2 54.37,18.11 55.16,18.91 LED1.K
N$34
  Top 0.305: Q1.3 39.91,24.77 37.86,22.72 3661BS.8
N$35
  Top 0.305: Q2.3 43.89,25.72 43.89,25.83 39.7,25.83 36.27,22.4 3661BS.9
N$36
  Top 0.305: Q3.3 46.56,26.86 39.86,26.86 33.18,22.4 3661BS.10
N$37
  Top 0.305: 3661BS.3 28.81,13.35 33.1,13.35 33.19,13.26 33.2,13.26 34.3,12.15 34.3,11.66 37.38,8.59 46.42,8.59 Q4.3
N$38
  Top 0.305: 3661BS.2 26.19,12.24 27.86,13.91 35.16,13.91 36.55,12.52 36.55,11.33 38.73,9.15 43.49,9.15 Q5.3
N$39
  Bottom 0.305: 3661BS.7 37.86,11.23 R19.2
N$40
  Bottom 0.305: R19.1 39.67,11.14 Q14.3
N$41
  Bottom 0.305: 3661BS.4 31.34,12.24 32.44,11.14 36.77,8.25 52.34,8.25 R16.2
N$42
  Bottom 0.305: 3661BS.14 23.89,23.67 31.25,23.67 37.97,27.8 47.37,27.8 50.03,25.14 R17.2
N$43
  Bottom 0.305: 3661BS.12 27.7,22.24 28.65,21.29 33.26,21.29 34.21,22.24 34.21,24.24 38.13,26.63 40.77,26.63 41.77,25.63 R13.2
N$44
  Bottom 0.305: Q12.3 52.29,25.1 R17.1
N$45
  Bottom 0.152: Q9.3 44.37,10.12 R14.1
USART1_RX
  Bottom 0.254: 13.46,11.33 U1.32
  Bottom 0.305: P2.PAD_PD4 12.14,9.22 12.14,10.6 12.52,10.98 13.11,10.98 13.46,11.33
USART1_TX  (via drill 0.3 pad 0.6)
  Top 0.305: v12.3,4.94 v12.29,4.93 P2.PAD_PU4
  Bottom 0.254: U1.29 14.96,11.72 15.83,10.85
  Bottom 0.305: 15.83,10.85 16.11,10.57 16.11,7 14.05,4.94 v12.3,4.94
USART2_RX
  Bottom 0.254: U1.14 18.73,17.98
  Bottom 0.305: 18.73,17.98 21.51,20.76 21.51,29.07 P2.PAD_PD2
USART2_TX  (via drill 0.3 pad 0.6)
  Top 0.305: P2.PAD_PU2 20.87,28.43 v20.87,27.32
  Bottom 0.254: 18.59,18.48 U1.13
  Bottom 0.305: v20.87,27.32 20.89,27.3 20.89,20.79 18.59,18.48
USART3_RX
  Bottom 0.254: U1.23 18.04,13.48 18.49,13.03 18.49,8.59
  Bottom 0.305: 18.49,8.59 P2.PAD_PD3
USART3_TX  (via drill 0.3 pad 0.6)
  Top 0.305: P2.PAD_PU3 20.87,6.21 v20.87,7.16
  Bottom 0.254: 18.95,9.08 18.95,13.22 18.19,13.98 U1.22
  Bottom 0.305: v20.87,7.16 18.95,9.08
USART5_RX
  Bottom 0.305: U1.40 6.86,14.48 6.21,13.83 4.17,13.83 P2.PAD_PD5
USART5_TX  (via drill 0.3 pad 0.6)
  Top 0.305: v3.09,16.05 1.96,16.05 P2.PAD_PU5
  Bottom 0.254: U1.41 6.91,14.98
  Bottom 0.305: v3.09,16.05 5.85,16.05 6.91,14.98
USART6_RX
  Bottom 0.254: U1.48 9.72,18.48
  Bottom 0.305: 9.72,18.48 9.44,18.76 9.44,28.12 P2.PAD_PD1
USART6_TX  (via drill 0.3 pad 0.6)
  Top 0.305: v7.22,27 7.85,27.63 P2.PAD_PU1
  Bottom 0.254: U1.47 9.52,17.98
  Bottom 0.305: 9.52,17.98 8.83,18.67 8.83,25.39 v7.22,27
VDD  (via drill 0.35 pad 0.75)
  Bottom 0.254: U1.31 13.96,10.93
  Bottom 0.305: 13.96,10.93 C5.1
  Bottom 0.406: FB1.2 10.4,27.96 v10.71,28.27 | v13.09,7.79 v13.1,7.8 C7.1 13.1,10.08 C5.1
  Bottom 0.61: D2.2 12.95,8.91 C7.1
  pour Top (rank 2, no thermals): 0.16,25.97 0.08,8.75 15,0.06 29.92,8.63 44.94,0.1 59.93,8.66 59.93,25.83 45.03,34.55 29.94,25.93 14.94,34.5 0.16,26.05
VDDA
  pour Bottom (no thermals): 14.05,18.75 14.05,19.38 13.25,20.18 11.19,20.18 11.19,26.21 9.76,26.21 9.76,19.54 12.46,19.54 12.78,19.23 12.78,18.75
VSSA
  Bottom 0.254: U1.7 14.46,19.47 13.8,20.12
  Bottom 0.305: 13.8,20.12 13.63,20.12 13.45,20.3 13.45,20.49 13.14,20.81 C3.2
  Bottom 0.508: C3.2 C1.2 12.2,22.78 C4.2 C2.2 R2.1
  pour Bottom: 12.94,20.5 12.94,26.21 11.72,26.21 11.67,20.5

### Text on the board
tPlace: 3V3 | 3V3 | R | P2* | 3V3 | P1 | 3V3 | 3V3 | P5 | 3661BS | 3V3 | 3V3 | 3V3 | P4* | P3 | 3V3 | 3V3
bPlace: H3BR70
tNames: B | C | D
bNames: GND | GND | P2* | R | GND | P1 | GND | GND | * | P5 | * | GND | GND | GND | P4* | P3 | GND | GND